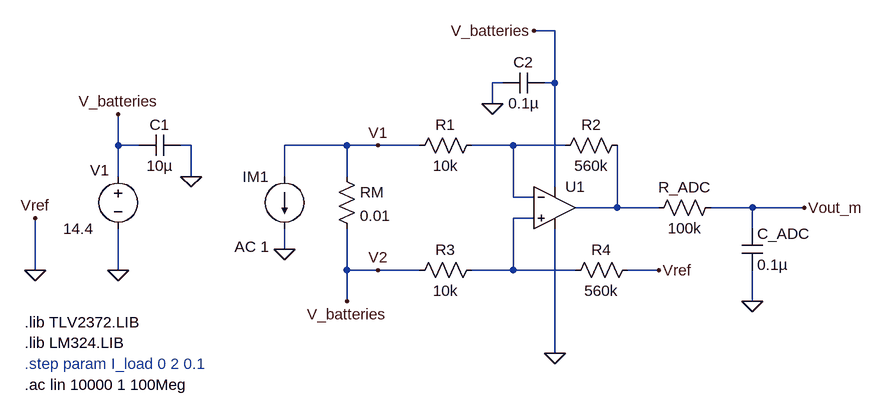
[diagram p0: schematic current_sense_interfaceSINGLEmotors_optimised.asc]
current_sense_interfaceSINGLEmotors_optimised.asc, the LTspice schematic file:
Version 4
SHEET 1 892 680
WIRE 400 -144 368 -144
WIRE 320 -64 304 -64
WIRE 400 -64 400 -144
WIRE 400 -64 384 -64
WIRE 304 -32 304 -64
WIRE -272 32 -272 -16
WIRE -240 32 -272 32
WIRE -160 32 -176 32
WIRE 80 32 -16 32
WIRE 128 32 80 32
WIRE 192 32 128 32
WIRE 336 32 272 32
WIRE 416 32 336 32
WIRE -272 80 -272 32
WIRE -160 80 -160 32
WIRE -16 80 -16 32
WIRE 80 80 80 32
WIRE 400 96 400 -64
WIRE 336 112 336 32
WIRE 368 112 336 112
WIRE 496 128 496 32
WIRE 496 128 432 128
WIRE 560 128 496 128
WIRE 704 128 640 128
WIRE 784 128 704 128
WIRE 368 144 336 144
WIRE 704 160 704 128
WIRE -16 192 -16 160
WIRE -400 224 -400 144
WIRE -272 224 -272 160
WIRE 80 224 80 160
WIRE 128 224 80 224
WIRE 192 224 128 224
WIRE 336 224 336 144
WIRE 336 224 272 224
WIRE 432 224 336 224
WIRE 560 224 512 224
WIRE 80 272 80 224
WIRE 704 272 704 224
WIRE 400 352 400 160
FLAG -16 192 0
FLAG 784 128 Vout_m
FLAG 560 224 Vref
FLAG 128 224 V2
FLAG 128 32 V1
FLAG 368 -144 V_batteries
FLAG 400 352 0
FLAG 80 272 V_batteries
FLAG -400 144 Vref
FLAG -400 224 0
FLAG -272 224 0
FLAG -272 -16 V_batteries
FLAG -160 80 0
FLAG 304 -32 0
FLAG 704 272 0
SYMBOL res 512 16 R90
WINDOW 0 0 56 VBottom 2
WINDOW 3 32 56 VTop 2
SYMATTR InstName R2
SYMATTR Value 560k
SYMATTR SpiceLine tol=1 pwr=0.6
SYMBOL res 528 208 R90
WINDOW 0 0 56 VBottom 2
WINDOW 3 32 56 VTop 2
SYMATTR InstName R4
SYMATTR Value 560k
SYMATTR SpiceLine tol=1 pwr=0.6
SYMBOL res 288 208 R90
WINDOW 0 0 56 VBottom 2
WINDOW 3 32 56 VTop 2
SYMATTR InstName R3
SYMATTR Value 10k
SYMATTR SpiceLine tol=1 pwr=0.6
SYMBOL res 288 16 R90
WINDOW 0 0 56 VBottom 2
WINDOW 3 32 56 VTop 2
SYMATTR InstName R1
SYMATTR Value 10k
SYMATTR SpiceLine tol=1 pwr=0.6
SYMBOL res 64 64 R0
SYMATTR InstName RM
SYMATTR Value 0.01
SYMATTR SpiceLine tol=1 pwr=1
SYMBOL current -16 80 M0
WINDOW 123 24 108 Left 2
WINDOW 39 0 0 Left 0
WINDOW 3 24 80 Invisible 2
SYMATTR Value2 AC 1
SYMATTR Value 0
SYMATTR InstName IM1
SYMBOL OpAmps\\opamp2 400 64 R0
WINDOW 3 16 96 Invisible 2
SYMATTR InstName U1
SYMATTR Value2 TLV2372
SYMBOL voltage -272 64 R0
WINDOW 0 -14 6 Right 2
WINDOW 3 -85 96 Left 2
WINDOW 123 0 0 Left 0
WINDOW 39 0 0 Left 0
SYMATTR InstName V1
SYMATTR Value 14.4
SYMBOL cap -176 16 R90
WINDOW 0 0 32 VBottom 2
WINDOW 3 32 32 VTop 2
SYMATTR InstName C1
SYMATTR Value 10µ
SYMBOL cap 384 -80 R90
WINDOW 0 0 32 VBottom 2
WINDOW 3 32 32 VTop 2
SYMATTR InstName C2
SYMATTR Value 0.1µ
SYMBOL res 656 112 R90
WINDOW 0 0 56 VBottom 2
WINDOW 3 32 56 VTop 2
SYMATTR InstName R_ADC
SYMATTR Value 100k
SYMBOL cap 688 160 R0
SYMATTR InstName C_ADC
SYMATTR Value 0.1µ
TEXT -416 368 Left 2 ;.step param I_load 0 2 0.1
TEXT -416 304 Left 2 !.lib TLV2372.LIB
TEXT -416 336 Left 2 !.lib LM324.LIB
TEXT -416 400 Left 2 !.ac lin 10000 1 100Meg

The netlist it stands for:
* current_sense_interfaceSINGLEmotors_optimised.asc
R2 N002 N001 560k tol=1 pwr=0.6
R4 0 N003 560k tol=1 pwr=0.6
R3 N003 V_batteries 10k tol=1 pwr=0.6
R1 N001 V1 10k tol=1 pwr=0.6
RM V1 V_batteries 0.01 tol=1 pwr=1
IM1 V1 0 0 AC 1
XU1 N003 N001 V_batteries 0 N002 opamp2 TLV2372  ; pins In+ In- V+ V- OUT
V1 V_batteries 0 14.4
C1 0 V_batteries 10µ
C2 V_batteries 0 0.1µ
R_ADC Vout_m N002 100k
C_ADC Vout_m 0 0.1µ
* .step param I_load 0 2 0.1
.lib TLV2372.LIB
.lib LM324.LIB
.ac lin 10000 1 100Meg
.backanno
.end